# Altium schematic sheet Sheet1.SchDoc
size A4; SheetNumber: 1; SheetTotal: 1
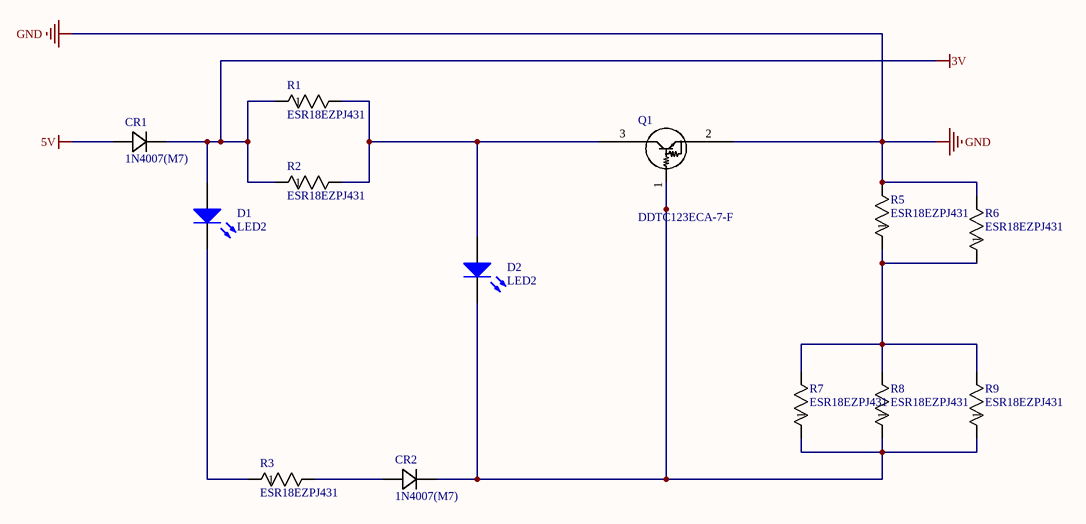
[diagram p0: Sheet1.SchDoc]

## Parts
CR1  1N4007(M7)  [CR_1N4007(M7)_YTS]
CR2  1N4007(M7)  [CR_1N4007(M7)_YTS]
D1  LED2  [3.2X1.6X1.1]
D2  LED2  [3.2X1.6X1.1]
Q1  DDTC123ECA-7-F  [SOT23_DIO]
R1  ESR18EZPJ431  [RES_R1206_ROM]
R2  ESR18EZPJ431  [RES_R1206_ROM]
R3  ESR18EZPJ431  [RES_R1206_ROM]
R5  ESR18EZPJ431  [RES_R1206_ROM]
R6  ESR18EZPJ431  [RES_R1206_ROM]
R7  ESR18EZPJ431  [RES_R1206_ROM]
R8  ESR18EZPJ431  [RES_R1206_ROM]
R9  ESR18EZPJ431  [RES_R1206_ROM]

## Nets
3V: CR1.1 D1.1(A) R1.1 R2.1
5V: CR1.2
GND: Q1.2 R5.2 R6.2
NetCR2_1: CR2.1 D2.2(K) Q1.1 R7.1 R8.1 R9.1
NetCR2_2: CR2.2 R3.2
NetD1_2: D1.2(K) R3.1
NetD2_1: D2.1(A) Q1.3 R1.2 R2.2
NetR5_1: R5.1 R6.1 R7.2 R8.2 R9.2

## Library data of the parts
CR1 CR2 = 1N4007(M7): No Description Available; Mfr_Name: UMW(Youtai Semiconductor Co., Ltd.); Type: DEV; Copyright: Copyright (C) 2022 Ultra Librarian. All rights reserved.; Manufacturer_Part_Number: 1N4007(M7); RefDes: RefDes
D1 D2 = LED2: Typical RED, GREEN, YELLOW, AMBER GaAs LED; Published: 8-Jun-2000; LatestRevisionDate: 17-Jul-2002; LatestRevisionNote: Re-released for DXP Platform.; PackageVersion: Feb-2002; PackageReference: 3.2X1.6X1.1; Publisher: Altium Limited; PackageDescription: SM LED; 2 Flat Leads
Q1 = DDTC123ECA-7-F: No Description Available; Mfr_Name: Diodes Inc; Type: DEV; Copyright: Copyright (C) 2022 Ultra Librarian. All rights reserved.; Manufacturer_Part_Number: DDTC123ECA-7-F; RefDes: RefDes
R1-R3 R5-R9 = ESR18EZPJ431: No Description Available; Mfr_Name: ROHM Semiconductor; Copyright: Copyright (C) 2022 Ultra Librarian. All rights reserved.; Manufacturer_Part_Number: ESR18EZPJ431; RefDes: RefDes; Type: DEV